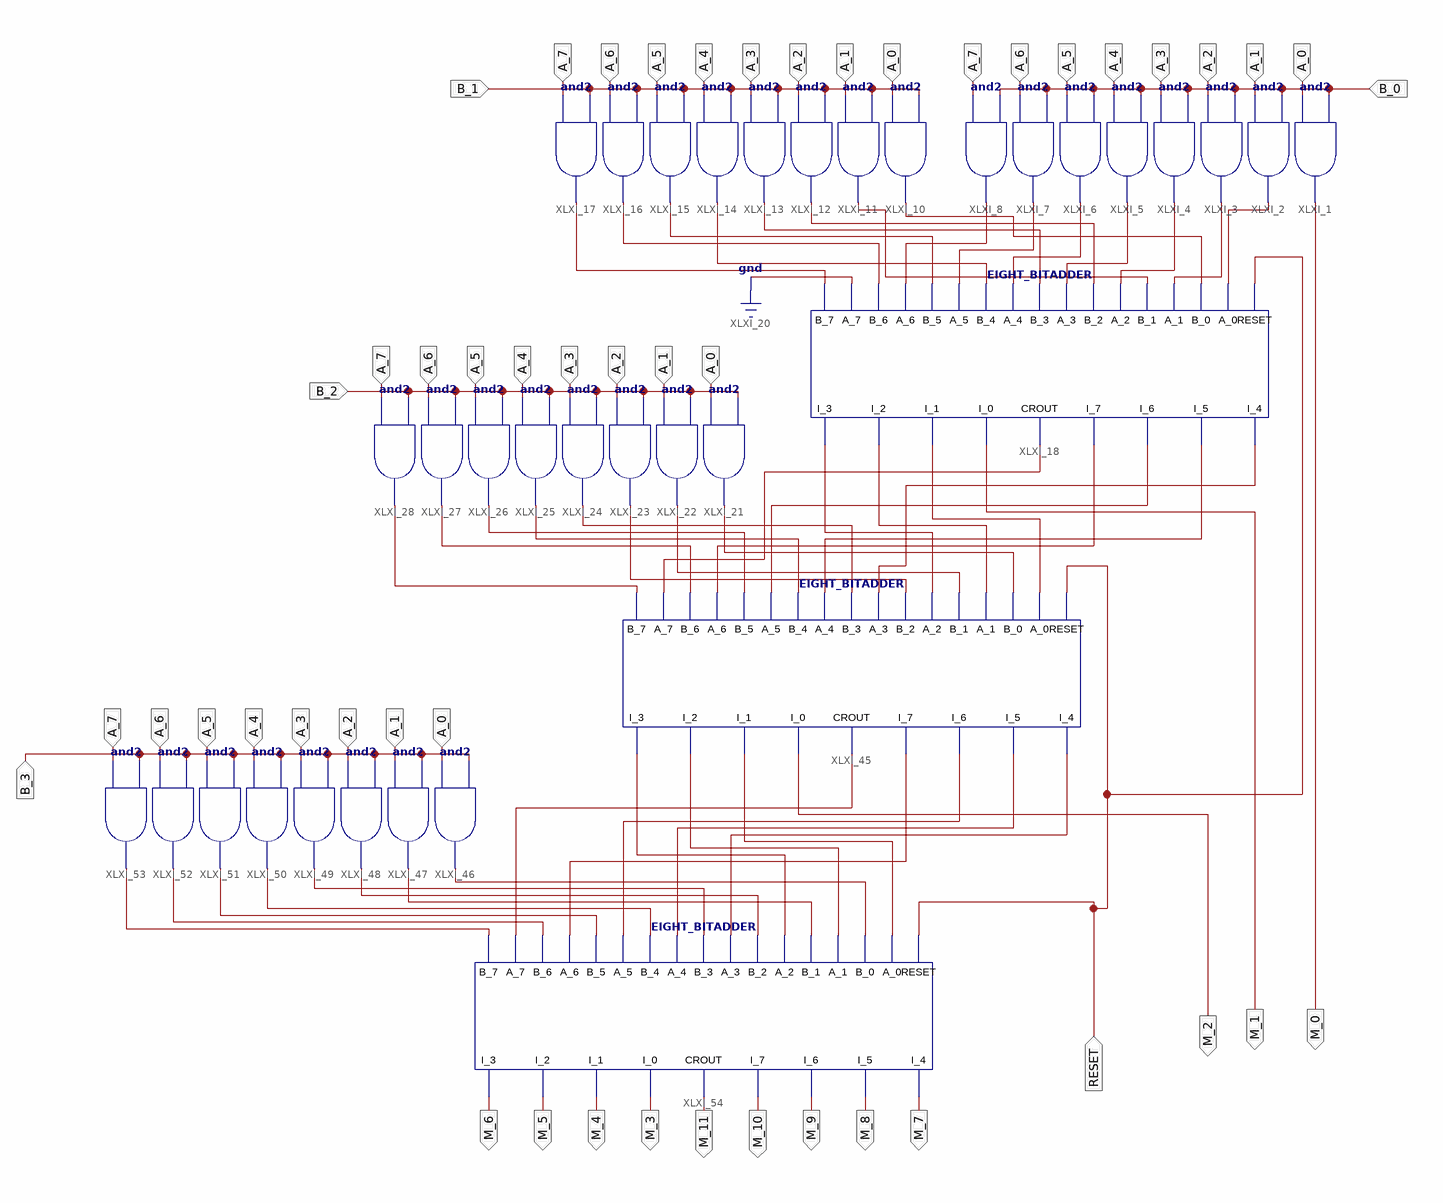
[diagram p0: schematic sheet 1]
// Xilinx ISE schematic Eight_Cross_four_Multiplier.sch (artix7) as structural Verilog: 35 symbols, 25 ports
module Eight_Cross_four_Multiplier (
  input  A_0,
  input  A_1,
  input  A_2,
  input  A_3,
  input  A_4,
  input  A_5,
  input  A_6,
  input  A_7,
  input  B_0,
  input  B_1,
  input  B_2,
  input  B_3,
  input  RESET,
  output M_0,
  output M_1,
  output M_2,
  output M_6,
  output M_5,
  output M_4,
  output M_3,
  output M_11,
  output M_10,
  output M_9,
  output M_8,
  output M_7
);

  wire XLXN_26, XLXN_27, XLXN_28, XLXN_29, XLXN_30, XLXN_31, XLXN_33, XLXN_35, XLXN_36, XLXN_38, XLXN_39,
       XLXN_41, XLXN_42, XLXN_50, XLXN_51, XLXN_83, XLXN_84, XLXN_86, XLXN_87, XLXN_88, XLXN_89, XLXN_90,
       XLXN_91, XLXN_92, XLXN_93, XLXN_94, XLXN_95, XLXN_96, XLXN_97, XLXN_98, XLXN_99, XLXN_118, XLXN_119,
       XLXN_120, XLXN_121, XLXN_122, XLXN_123, XLXN_124, XLXN_125, XLXN_126, XLXN_127, XLXN_128, XLXN_129,
       XLXN_130, XLXN_131, XLXN_133, XLXN_134;

  and XLXI_1 (M_0, A_0, B_0);
  and XLXI_2 (XLXN_26, A_1, B_0);
  and XLXI_3 (XLXN_27, A_2, B_0);
  and XLXI_4 (XLXN_28, A_3, B_0);
  and XLXI_5 (XLXN_29, A_4, B_0);
  and XLXI_6 (XLXN_30, A_5, B_0);
  and XLXI_7 (XLXN_31, A_6, B_0);
  and XLXI_8 (XLXN_33, A_7, B_0);
  and XLXI_10 (XLXN_35, A_0, B_1);
  and XLXI_11 (XLXN_36, A_1, B_1);
  and XLXI_12 (XLXN_38, A_2, B_1);
  and XLXI_13 (XLXN_39, A_3, B_1);
  and XLXI_14 (XLXN_41, A_4, B_1);
  and XLXI_15 (XLXN_42, A_5, B_1);
  and XLXI_16 (XLXN_50, A_6, B_1);
  and XLXI_17 (XLXN_51, A_7, B_1);
  EIGHT_BITADDER XLXI_18 (
    .RESET(RESET), .A_0(XLXN_26), .B_0(XLXN_35), .A_1(XLXN_27), .B_1(XLXN_36), .A_2(XLXN_28), .B_2(XLXN_38),
    .A_3(XLXN_29), .B_3(XLXN_39), .A_4(XLXN_30), .B_4(XLXN_41), .A_5(XLXN_31), .B_5(XLXN_42), .A_6(XLXN_33),
    .B_6(XLXN_50), .A_7(1'b0), .B_7(XLXN_51), .I_4(XLXN_87), .I_5(XLXN_88), .I_6(XLXN_89), .I_7(XLXN_90),
    .CROUT(XLXN_91), .I_0(M_1), .I_1(XLXN_83), .I_2(XLXN_84), .I_3(XLXN_86));
  and XLXI_21 (XLXN_92, A_0, B_2);
  and XLXI_22 (XLXN_93, A_1, B_2);
  and XLXI_23 (XLXN_94, A_2, B_2);
  and XLXI_24 (XLXN_95, A_3, B_2);
  and XLXI_25 (XLXN_96, A_4, B_2);
  and XLXI_26 (XLXN_97, A_5, B_2);
  and XLXI_27 (XLXN_98, A_6, B_2);
  and XLXI_28 (XLXN_99, A_7, B_2);
  EIGHT_BITADDER XLXI_45 (
    .RESET(RESET), .A_0(XLXN_83), .B_0(XLXN_92), .A_1(XLXN_84), .B_1(XLXN_93), .A_2(XLXN_86), .B_2(XLXN_94),
    .A_3(XLXN_87), .B_3(XLXN_95), .A_4(XLXN_88), .B_4(XLXN_96), .A_5(XLXN_89), .B_5(XLXN_97), .A_6(XLXN_90),
    .B_6(XLXN_98), .A_7(XLXN_91), .B_7(XLXN_99), .I_4(XLXN_121), .I_5(XLXN_122), .I_6(XLXN_123),
    .I_7(XLXN_124), .CROUT(XLXN_134), .I_0(M_2), .I_1(XLXN_118), .I_2(XLXN_119), .I_3(XLXN_120));
  and XLXI_46 (XLXN_125, A_0, B_3);
  and XLXI_47 (XLXN_126, A_1, B_3);
  and XLXI_48 (XLXN_127, A_2, B_3);
  and XLXI_49 (XLXN_128, A_3, B_3);
  and XLXI_50 (XLXN_129, A_4, B_3);
  and XLXI_51 (XLXN_130, A_5, B_3);
  and XLXI_52 (XLXN_131, A_6, B_3);
  and XLXI_53 (XLXN_133, A_7, B_3);
  EIGHT_BITADDER XLXI_54 (
    .RESET(RESET), .A_0(XLXN_118), .B_0(XLXN_125), .A_1(XLXN_119), .B_1(XLXN_126), .A_2(XLXN_120),
    .B_2(XLXN_127), .A_3(XLXN_121), .B_3(XLXN_128), .A_4(XLXN_122), .B_4(XLXN_129), .A_5(XLXN_123),
    .B_5(XLXN_130), .A_6(XLXN_124), .B_6(XLXN_131), .A_7(XLXN_134), .B_7(XLXN_133), .I_4(M_7), .I_5(M_8),
    .I_6(M_9), .I_7(M_10), .CROUT(M_11), .I_0(M_3), .I_1(M_4), .I_2(M_5), .I_3(M_6));
endmodule
